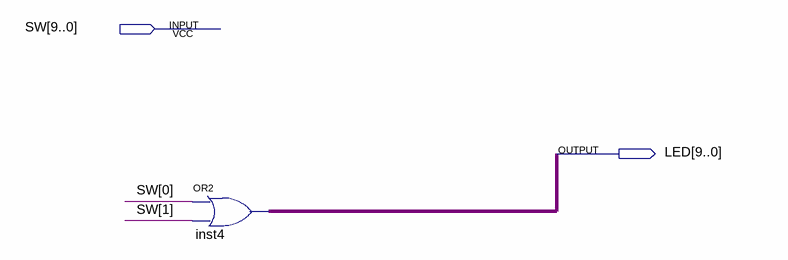
[diagram p0: schematic sheet]
// Quartus schematic testBus.bdf as structural Verilog: 1 symbols, 2 pins
module testBus (
  input  [9:0] SW,
  output [9:0] LED
);

  assign LED = {10{SW[0]}} | {10{SW[1]}};  // OR2 inst4, 10 bits wide
endmodule
